# EAGLE design AJH_as3340_20 (EAGLE 9.6.2)
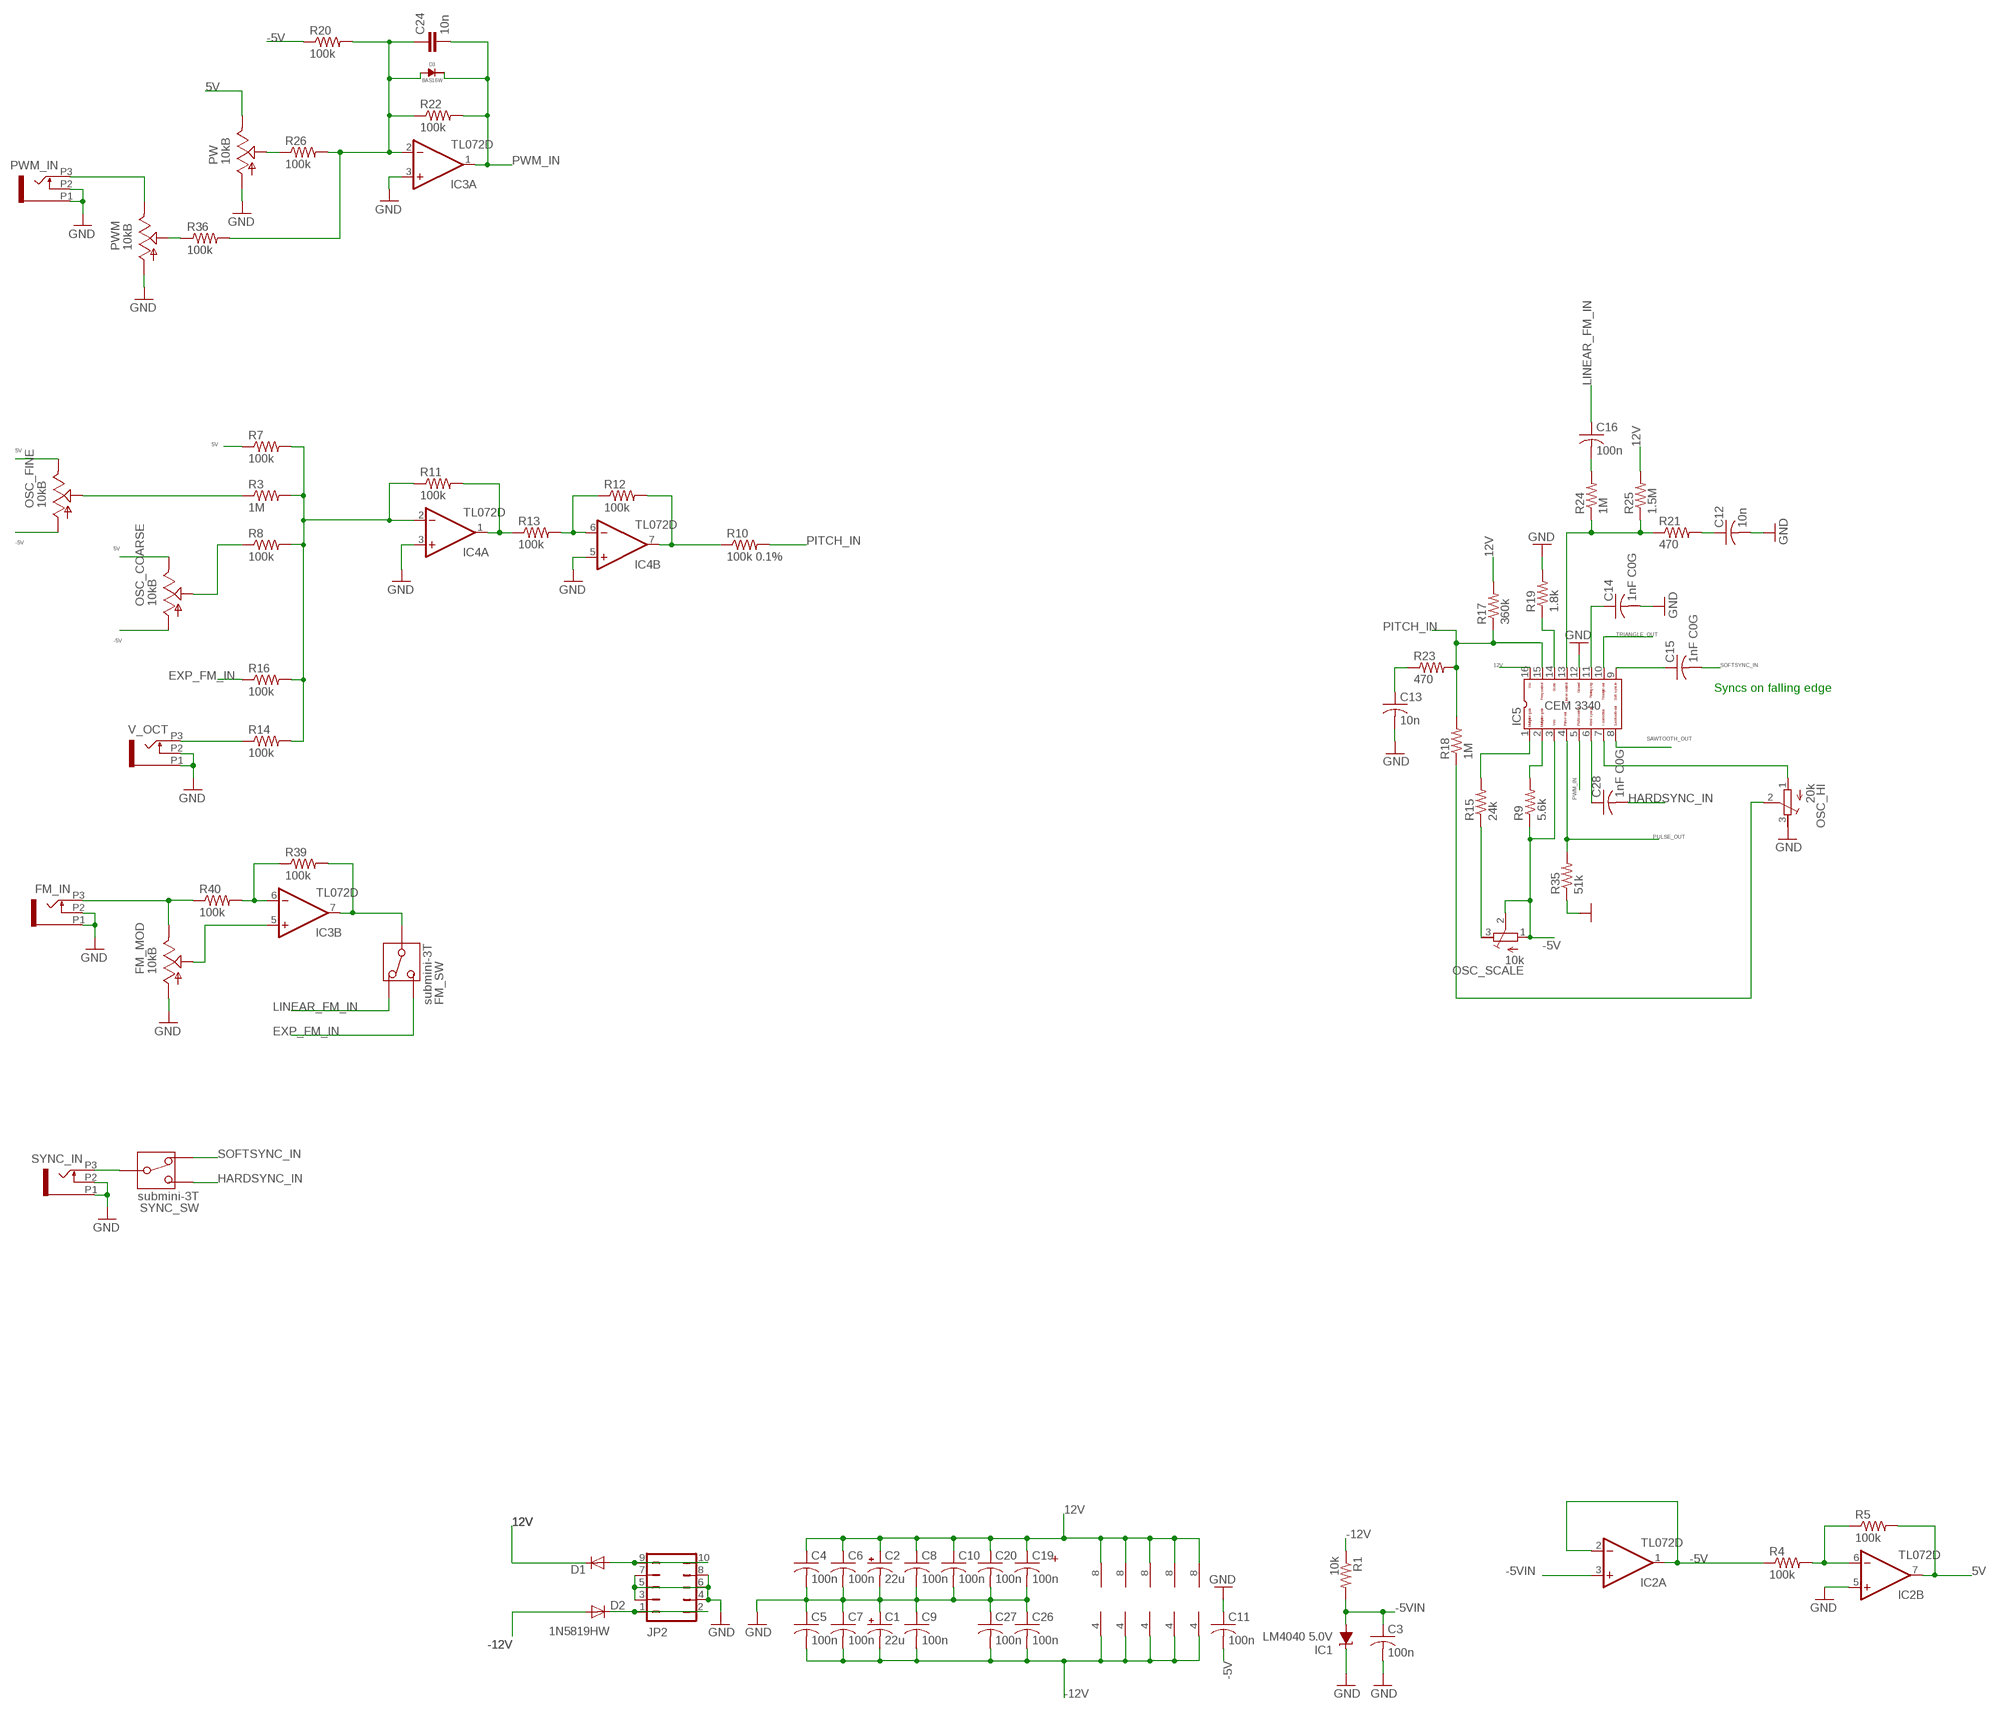
[diagram p0: schematic, sheet 1, part 1 of 2]
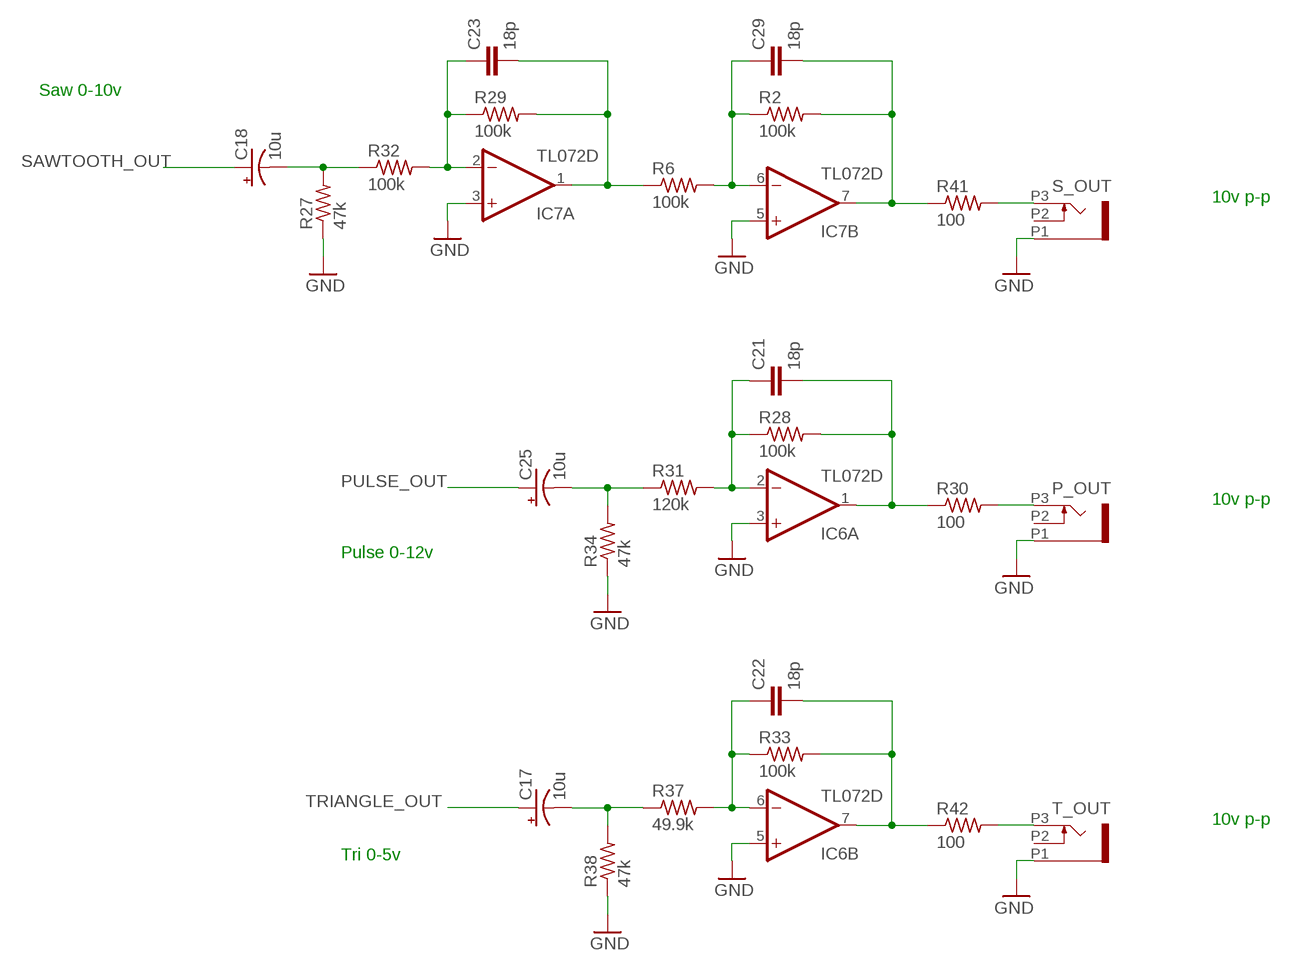
[diagram p1: schematic, sheet 1, part 2 of 2]

## Parts
C1  22u  CPOL-USB  [PANASONIC_B]
C2  22u  CPOL-USB  [PANASONIC_B]
C3  100n  C-USC0603  [C0603]
C4  100n  C-USC0603  [C0603]
C5  100n  C-USC0603  [C0603]
C6  100n  C-USC0603  [C0603]
C7  100n  C-USC0603  [C0603]
C8  100n  C-USC0603  [C0603]
C9  100n  C-USC0603  [C0603]
C10  100n  C-USC0603  [C0603]
C11  100n  C-USC0603  [C0603]
C12  10n  C-USC0603  [C0603]
C13  10n  C-USC0603  [C0603]
C14  1nF C0G  C-USC0603  [C0603]
C15  1nF C0G  C-USC0603  [C0603]
C16  100n  C-USC0603  [C0603]
C17  10u  CPOL-USB  [PANASONIC_B]
C18  10u  CPOL-USB  [PANASONIC_B]
C19  100n  C-USC0603  [C0603]
C20  100n  C-USC0603  [C0603]
C21  18p  C-EUC0603  [C0603]
C22  18p  C-EUC0603  [C0603]
C23  18p  C-EUC0603  [C0603]
C24  10n  C-EUC0603  [C0603]
C25  10u  CPOL-USB  [PANASONIC_B]
C26  100n  C-USC0603  [C0603]
C27  100n  C-USC0603  [C0603]
C28  1nF C0G  C-USC0603  [C0603]
C29  18p  C-EUC0603  [C0603]
D1  1N5819HW  DIODE-SOD123  [SOD123]
D2  1N5819HW  DIODE-SOD123  [SOD123]
D3  BAS16W  [SOT-323]
FM_IN  PJ301_THONKICONN6  [WQP_PJ_301M6]
FM_MOD  10kB  POT_USVERTICAL_PS  [ALPS_POT_VERTICAL_PS]
FM_SW  submini-3T  SPDTT  [SPDT-SUB]
IC1  LM4040 5.0V  LM4041C12DBZ  [DBZ_R-PDSO-G3]
IC2  TL072D  [SO08]
IC3  TL072D  [SO08]
IC4  TL072D  [SO08]
IC5  CEM3340SOIC16  [SO16]
IC6  TL072D  [SO08]
IC7  TL072D  [SO08]
JP2  JP5Q  [JP5Q]
OSC_COARSE  10kB  POT_USVERTICAL  [ALPS_POT_VERTICAL]
OSC_FINE  10kB  POT_USVERTICAL  [ALPS_POT_VERTICAL]
OSC_HI  20k  R-TRIMM3296X  [RTRIM3296X]
OSC_SCALE  10k  R-TRIMM3296X  [RTRIM3296X]
P_OUT  PJ301_THONKICONN6  [WQP_PJ_301M6]
PW  10kB  POT_USVERTICAL_PS  [ALPS_POT_VERTICAL_PS]
PWM  10kB  POT_USVERTICAL_PS  [ALPS_POT_VERTICAL_PS]
PWM_IN  PJ301_THONKICONN6  [WQP_PJ_301M6]
R1  10k  R-US_R0603  [R0603]
R2  100k  R-US_R0603  [R0603]
R3  1M  R-US_R0603  [R0603]
R4  100k  R-US_R0603  [R0603]
R5  100k  R-US_R0603  [R0603]
R6  100k  R-US_R0603  [R0603]
R7  100k  R-US_R0603  [R0603]
R8  100k  R-US_R0603  [R0603]
R9  5.6k  R-US_R0603  [R0603]
R10  100k 0.1%  R-US_R0603  [R0603]
R11  100k  R-US_R0603  [R0603]
R12  100k  R-US_R0603  [R0603]
R13  100k  R-US_R0603  [R0603]
R14  100k  R-US_R0603  [R0603]
R15  24k  R-US_R0603  [R0603]
R16  100k  R-US_R0603  [R0603]
R17  360k  R-US_R0603  [R0603]
R18  1M  R-US_R0603  [R0603]
R19  1.8k  R-US_R0603  [R0603]
R20  100k  R-US_R0603  [R0603]
R21  470  R-US_R0603  [R0603]
R22  100k  R-US_R0603  [R0603]
R23  470  R-US_R0603  [R0603]
R24  1M  R-US_R0603  [R0603]
R25  1.5M  R-US_R0603  [R0603]
R26  100k  R-US_R0603  [R0603]
R27  47k  R-US_R0603  [R0603]
R28  100k  R-US_R0603  [R0603]
R29  100k  R-US_R0603  [R0603]
R30  100  R-US_R0603  [R0603]
R31  120k  R-US_R0603  [R0603]
R32  100k  R-US_R0603  [R0603]
R33  100k  R-US_R0603  [R0603]
R34  47k  R-US_R0603  [R0603]
R35  51k  R-US_R0603  [R0603]
R36  100k  R-US_R0603  [R0603]
R37  49.9k  R-US_R0603  [R0603]
R38  47k  R-US_R0603  [R0603]
R39  100k  R-US_R0603  [R0603]
R40  100k  R-US_R0603  [R0603]
R41  100  R-US_R0603  [R0603]
R42  100  R-US_R0603  [R0603]
S_OUT  PJ301_THONKICONN6  [WQP_PJ_301M6]
SYNC_IN  PJ301_THONKICONN6  [WQP_PJ_301M6]
SYNC_SW  submini-3T  SPDTT  [SPDT-SUB]
T_OUT  PJ301_THONKICONN6  [WQP_PJ_301M6]
V_OCT  PJ301_THONKICONN6  [WQP_PJ_301M6]

## Nets
5V [power]: IC2.7(B:OUT) OSC_COARSE.P$1(E) OSC_FINE.P$1(E) PW.P$1(E) R5.2 R7.1
12V [power]: C2.+ C4.1 C6.1 C8.1 C10.1 C19.1 C20.1 D1.C IC2.8(P:V+) IC3.8(P:V+) IC4.8(P:V+) IC5.16 IC6.8(P:V+) IC7.8(P:V+) R17.2 R25.2
-5V [power]: C11.2 IC2.1(A:OUT) IC2.2(A:-IN) IC5.3 OSC_COARSE.P$3(A) OSC_FINE.P$3(A) OSC_SCALE.1(E) OSC_SCALE.2(S) R4.1 R9.1 R20.1
-5VIN [power]: C3.1 IC1.2(A) IC2.3(A:+IN) R1.2
-12V [power]: C1.- C5.2 C7.2 C9.2 C26.2 C27.2 D2.A IC2.4(P:V-) IC3.4(P:V-) IC4.4(P:V-) IC6.4(P:V-) IC7.4(P:V-) R1.1
EXP_FM_IN: FM_SW.P$1 R16.1
GND [power]: C1.+ C2.- C3.2 C4.2 C5.1 C6.2 C7.1 C8.2 C9.1 C10.2 C11.1 C12.2 C13.2 C14.2 C19.2 C20.2 C26.1 C27.1 FM_IN.P1 FM_IN.P2 FM_MOD.P$3(A) IC1.1(C) IC2.5(B:+IN) IC3.3(A:+IN) IC4.3(A:+IN) IC4.5(B:+IN) IC5.12 IC6.3(A:+IN) IC6.5(B:+IN) IC7.3(A:+IN) IC7.5(B:+IN) JP2.3 JP2.4 JP2.5 JP2.6 JP2.7 JP2.8 OSC_HI.3(A) P_OUT.P1 PW.P$3(A) PWM.P$3(A) PWM_IN.P1 PWM_IN.P2 R19.2 R27.1 R34.1 R35.1 R38.1 S_OUT.P1 SYNC_IN.P1 SYNC_IN.P2 T_OUT.P1 V_OCT.P1 V_OCT.P2
HARDSYNC_IN: C28.2 SYNC_SW.P$1
LINEAR_FM_IN: C16.1 FM_SW.P$3
MAIN_CV1: PWM.P$1(E) PWM_IN.P3
N$1: PW.P$2(S) R26.1
N$2: R41.2 S_OUT.P3
N$3: FM_MOD.P$2(S) IC3.5(B:+IN)
N$4: OSC_COARSE.P$2(S) R8.1
N$5: IC3.6(B:-IN) R39.1 R40.2
N$6 [power]: D1.A JP2.9 JP2.10
N$7: IC4.2(A:-IN) R3.2 R7.2 R8.2 R11.1 R14.2 R16.2
N$8: IC4.1(A:OUT) R11.2 R13.1
N$9: IC4.6(B:-IN) R12.1 R13.2
N$10: R14.1 V_OCT.P3
N$11: OSC_FINE.P$2(S) R3.1
N$12: FM_SW.P$2 IC3.7(B:OUT) R39.2
N$13: IC2.6(B:-IN) R4.2 R5.1
N$14: P_OUT.P3 R30.2
N$15: C29.1 IC7.6(B:-IN) R2.1 R6.2
N$16: R42.2 T_OUT.P3
N$17: C18.- R27.2 R32.1
N$18: C25.- R31.1 R34.2
N$19: C17.- R37.1 R38.2
N$20 [power]: D2.C JP2.1 JP2.2
N$21: C23.1 IC7.2(A:-IN) R29.1 R32.2
N$23: C23.2 IC7.1(A:OUT) R6.1 R29.2
N$24: C21.2 IC6.1(A:OUT) R28.2 R30.1
N$25: C22.2 IC6.7(B:OUT) R33.2 R42.1
N$26: C22.1 IC6.6(B:-IN) R33.1 R37.2
N$27: C21.1 IC6.2(A:-IN) R28.1 R31.2
N$28: C15.1 IC5.9
N$29: C13.1 R23.1
N$30: OSC_HI.2(S) R18.1
N$31: IC5.1 R15.2
N$32: OSC_SCALE.3(A) R15.1
N$33: IC5.2 R9.2
N$34: IC5.14 R19.1
N$35: C14.1 IC5.11
N$36: C12.1 R21.2
N$37: IC5.13 R21.1 R24.1 R25.1
N$38: C16.2 R24.2
N$40: C29.2 IC7.7(B:OUT) R2.2 R41.1
N$82: FM_IN.P3 FM_MOD.P$1(E) R40.1
N$94: C28.1 IC5.6
N$100: IC5.7 OSC_HI.1(E)
N$103: PWM.P$2(S) R36.1
PITCH_IN: IC5.15 R10.2 R17.1 R18.2 R23.2
PRESUMMED_PITCH: IC4.7(B:OUT) R10.1 R12.2
PULSE_OUT: C25.+ IC5.4 R35.2
PWM_2_IN_SUM: C24.1 D3.ANODE IC3.2(A:-IN) R20.2 R22.1 R26.2 R36.2
PWM_IN: C24.2 D3.CATHODE IC3.1(A:OUT) IC5.5 R22.2
SAWTOOTH_OUT: C18.+ IC5.8
SOFTSYNC_IN: C15.2 SYNC_SW.P$3
SYNC_IN: SYNC_IN.P3 SYNC_SW.P$2
TRIANGLE_OUT: C17.+ IC5.10
Unconnected: P_OUT.P2 S_OUT.P2 T_OUT.P2

## Notes on the sheet
- Saw 0-10v
- 10v p-p
- Syncs on falling edge
- 10v p-p
- Pulse 0-12v
- 10v p-p
- Tri 0-5v
- +

## Library data of the parts
C1 C2 C17 C18 C25 = rcl:CPOL-US: POLARIZED CAPACITOR, American symbol
C3-C16 C19 C20 C26-C28 = rcl:C-US: CAPACITOR, American symbol
C21-C24 C29 = resistor:C-EU: CAPACITOR, European symbol
D1 D2 = diode:DIODE-: DIODE
D3 = FenixBase:BAS16W
FM_IN P_OUT PWM_IN S_OUT SYNC_IN T_OUT V_OCT = og-pj301_variations:PJ301_THONKICONN
FM_MOD PW PWM = pot-alps:POT_US
FM_SW SYNC_SW = malekko main:SPDT: SPDT Switch
IC1 = texas:LM4041: PRECISION MICROPOWER SHUNT VOLTAGE REFERENCE Source: http://focus.ti.com/lit/ds/slcs146e/slcs146e.pdf
IC2-IC4 IC6 IC7 = linear:TL072: OP AMP
IC5 = CEM:CEM3340: CEM 3340 VCO
JP2 = jumper:JP5Q: JUMPER
OSC_COARSE OSC_FINE = og-pots:POT_US
OSC_HI OSC_SCALE = rcl:R-TRIMM: Trimm resistor
R1-R42 = resistor:R-US_: RESISTOR, American symbol

## Net classes
0 default: width 0.203 mm, drill 0.203 mm, clearance 0.203 mm
1 power: width 0.305 mm, drill 0.305 mm, clearance 0.305 mm to class 0, clearance 0.305 mm

## Board
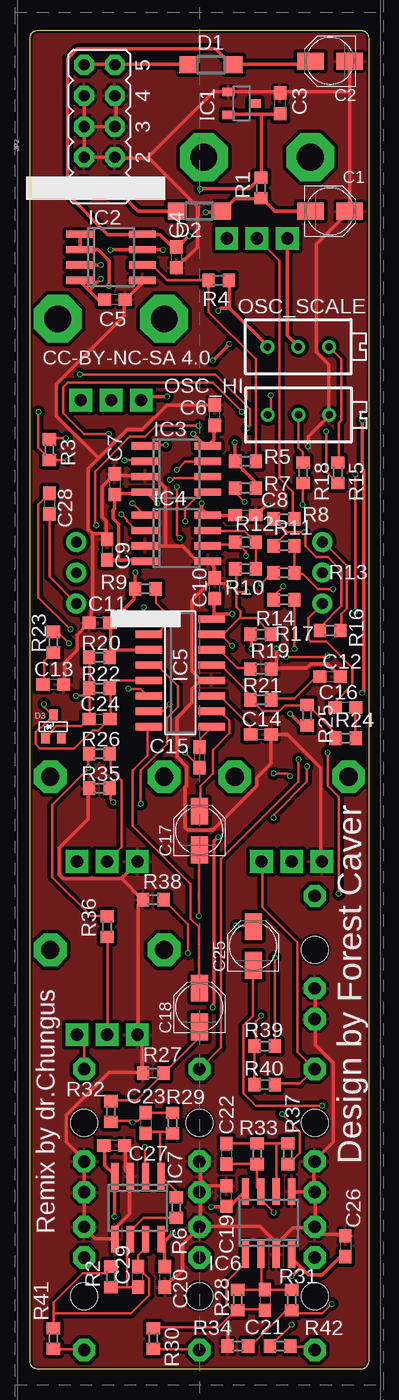
[diagram p2: board, top side]
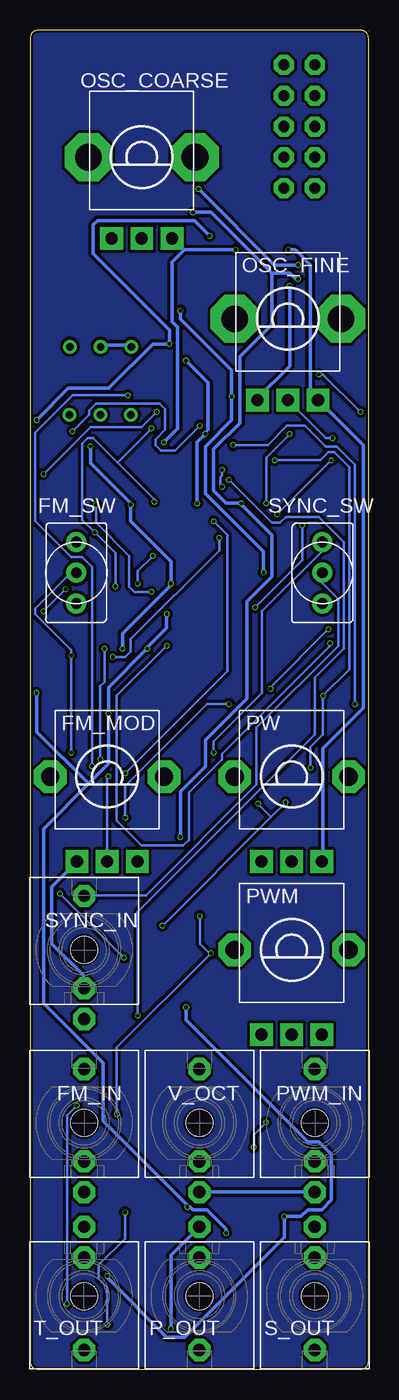
[diagram p3: board, bottom side, seen from below]

Size 27.94 x 110.49 mm. Coordinates in mm from the lower left corner, seen from the top.
Copper layers (1*16): Top 0.035mm / dielectric 1.6mm / Bottom 0.035mm
Design rules "jlcpcb-2layers *": minimum track width 5mil, minimum drill 0.3mm, track to track 10mil, track to pad 10mil, pad to pad 10mil, via to via 10mil, smd to smd 5mil, copper to edge 0.2mm, drill to drill 6mil, minimum pad ring 10mil, minimum via ring 3mil, stop-mask expansion 4mil, vias tented up to drill 0mil, thermal gap 10mil

### Footprints (pad centres in the part's own frame; a part is rotated, then mirrored left to right if it is on the bottom)
PANASONIC_B = smd 2.2 x 1.4: + 1.6,0; - -1.6,0
C0603 = smd 1.1 x 1: 1 -0.85,0; 2 0.85,0
SOD123 = smd 1.4 x 1.4: A 1.9,0; C -1.9,0
SOT-323 = smd 0.7 x 0.9: ANODE -0.65,-0.95; CATHODE 0,0.95; NC 0.65,-0.95
WQP_PJ_301M6 = drill 1.016 pad 1.778 octagon: P1 0,-5.715; P2 0,-3.175; P3 0,4.445 | hole 2.2: 0,0
ALPS_POT_VERTICAL_PS = drill 1 pad 1.88 square: P$1 -2.5,7; P$2 0,7; P$3 2.5,7 | drill 1.5 pad 2.54 octagon: P$4 -4.7,0; P$5 4.7,0
SPDT-SUB = drill 0.889 pad 1.651: P$1 0,2.54; P$2 0,0; P$3 0,-2.54
DBZ_R-PDSO-G3 = smd 0.7 x 1: 1 -0.95,-1.1; 2 0.95,-1.1; 3 0,1.1
SO08 = smd 0.6 x 2.2: 1 -1.905,-2.6; 2 -0.635,-2.6; 3 0.635,-2.6; 4 1.905,-2.6; 5 1.905,2.6; 6 0.635,2.6; 7 -0.635,2.6; 8 -1.905,2.6
SO16 = smd 0.6 x 2.2: 1 -4.445,-2.6; 2 -3.175,-2.6; 3 -1.905,-2.6; 4 -0.635,-2.6; 5 0.635,-2.6; 6 1.905,-2.6; 7 3.175,-2.6; 8 4.445,-2.6; 9 4.445,2.6; 10 3.175,2.6; 11 1.905,2.6; 12 0.635,2.6; 13 -0.635,2.6; 14 -1.905,2.6; 15 -3.175,2.6; 16 -4.445,2.6
JP5Q = drill 0.914 octagon: 1 -5.08,-1.27; 2 -5.08,1.27; 3 -2.54,-1.27; 4 -2.54,1.27; 5 0,-1.27; 6 0,1.27; 7 2.54,-1.27; 8 2.54,1.27; 9 5.08,-1.27; 10 5.08,1.27
ALPS_POT_VERTICAL = drill 1 pad 1.88 square: P$1 -2.5,6.7; P$2 0,6.7; P$3 2.5,6.7 | drill 2.2 pad 3.175 octagon: P$4 -4.4,0; P$5 4.4,0
RTRIM3296X = drill 0.61: 1 0,-2.54; 2 0,0; 3 0,2.54
R0603 = smd 1 x 1.1: 1 -0.85,0; 2 0.85,0

### Placement (x,y rotation side)
C1  24.77,95.57 0 top
C2  24.77,107.95 180 top
C3  20.64,104.46 90 top
C4  12.07,91.76 270 top
C5  6.99,88.27 180 top
C6  15.24,78.74 90 top
C7  6.99,73.03 270 top
C8  17.78,70.48 0 top
C9  6.35,67.64 270 top
C10  15.24,64.45 90 top
C11  5.71,61.59 0 top
C12  24.77,57.15 0 top
C13  1.9,56.52 0 top
C14  19.05,52.39 0 top
C15  13.97,50.48 270 top
C16  26.04,54.61 0 top
C17  13.97,44.45 90 top
C18  13.97,29.84 90 top
C19  16.19,14.29 90 top
C20  11.11,7.62 270 top
C21  19.37,5.71 270 top
C22  16.19,17.78 270 top
C23  9.53,20.32 270 top
C24  5.71,53.66 0 top
C25  18.41,34.92 90 top
C26  26.04,10.16 270 top
C27  6.94,18.46 180 top
C28  1.59,71.44 270 top
C29  8.89,7.62 90 top
D1  14.92,107.63 180 top
D2  13.97,95.57 0 top
D3  1.9,53.02 0 top
FM_IN  23.5,20.32 0 bottom
FM_MOD  21.59,48.89 180 bottom
FM_SW  24.13,65.72 0 bottom
IC1  17.46,104.46 270 top
IC2  6.67,91.76 270 top
IC3  12.07,74.3 270 top
IC4  12.07,68.58 270 top
IC5  12.38,57.47 270 top
IC6  19.68,12.06 0 top
IC7  8.89,13.34 180 top
JP2  5.71,102.55 90 top
OSC_COARSE  18.73,100.01 180 bottom
OSC_FINE  6.67,86.68 180 bottom
OSC_HI  22.16,78.75 270 top
OSC_SCALE  22.13,84.38 270 top
P_OUT  13.97,6.03 180 bottom
PW  6.35,48.89 180 bottom
PWM  6.35,34.61 180 bottom
PWM_IN  4.45,20.32 0 bottom
R1  19.05,97.47 90 top
R2  6.67,7.62 90 top
R3  1.59,75.88 270 top
R4  15.56,89.85 180 top
R5  17.78,74.93 180 top
R6  12.07,13.34 270 top
R7  17.78,72.71 180 top
R8  20.96,70.17 180 top
R9  9.5,64.39 0 top
R10  17.78,66.04 180 top
R11  20.96,67.94 0 top
R12  17.78,68.26 0 top
R13  20.96,65.72 180 top
R14  20.96,63.5 180 top
R15  25.4,73.98 270 top
R16  24.77,60.96 180 top
R17  19.05,60.64 180 top
R18  22.54,73.98 270 top
R19  19.05,57.78 0 top
R20  5.71,58.74 180 top
R21  19.05,55.25 0 top
R22  5.71,56.2 0 top
R23  1.9,60.01 90 top
R24  26.04,52.07 0 top
R25  22.86,53.98 270 top
R26  5.71,50.8 180 top
R27  10.16,24.45 0 top
R28  17.14,5.71 270 top
R29  11.75,20.32 270 top
R30  10.16,2.54 270 top
R31  21.59,5.71 90 top
R32  6.67,21.27 270 top
R33  18.73,17.78 270 top
R34  17.14,1.9 0 top
R35  5.71,47.94 0 top
R36  6.35,36.51 90 top
R37  21.27,17.78 90 top
R38  10.16,38.73 0 top
R39  19.37,26.67 0 top
R40  19.37,23.49 180 top
R41  1.9,2.54 270 top
R42  20.64,1.9 0 top
S_OUT  4.45,6.03 180 bottom
SYNC_IN  23.5,34.61 0 bottom
SYNC_SW  3.81,65.72 180 bottom
T_OUT  23.5,6.03 180 bottom
U$1  [EURO_PCB_6HP]  -1.27,-8.89 0 top  (outside the outline)
V_OCT  13.97,20.32 0 bottom

### Tracks (layer width: path | path; a pad name or v marks a point on that pad's centre or on a via)
5V  (via drill 0.3)
  Top 0.305: R7.1 18.62,72.72 18.62,73.18 16.9,74.89 R5.2 16.9,75.01 v16.9,76.49 | v10.96,92.38 9.36,92.38 IC2.7 9.13,92.38 v6.62,92.38
  Bottom 0.305: 15.3,92.38 v10.96,92.38 | 15.3,92.38 16.22,93.29 OSC_COARSE.P$1 | v16.9,76.49 15.76,77.64 15.76,85.98 16.22,86.44 16.22,91.35 15.3,92.27 15.3,92.38 | PW.P$1 3.76,41.97 3.76,51.23 0.44,54.55 0.44,76.26 4.1,79.92 OSC_FINE.P$1 4.22,80.03 4.79,80.61 4.79,91.12 6.04,92.38 v6.62,92.38
12V  (via drill 0.3)
  Top 0.305: C6.1 15.19,77.86 15.19,76.72 14.73,76.26 IC3.8 14.62,76.26 14.39,76.26 v13.47,77.18 | C8.1 16.9,70.43 14.73,70.43 IC4.8 14.62,70.55 14.16,71.01 v14.16,71.46 | C2.+ 23.08,107.92 22.85,107.7 16.9,107.7 D1.C 16.68,107.58 15.3,108.95 3.87,108.95 3.07,108.15 3.07,96.95 6.39,93.64 9.13,93.64 IC2.8 9.36,93.64 10.73,93.64 11.76,92.61 11.99,92.61 C4.1 12.22,92.61 v13.13,93.52 | v16.45,84.61 v15.07,83.24 | IC6.8 17.7,14.66 16.56,13.51 16.22,13.51 C19.1 16.1,13.4 v14.96,13.4 | C20.1 11.07,8.48 11.07,10.43 10.85,10.66 IC7.8 11.07,10.54 v11.76,11.23 | 15.19,62.32 15.19,62.09 15.07,61.98 IC5.16 | 15.19,62.32 15.19,63.58 C10.1 | v21.48,54.09 22.39,53.17 22.85,53.17 R25.2 | v18.28,59.46 18.28,60.6 R17.2 | v16.68,62.32 15.19,62.32 | v27.42,78.32 27.42,74.32 27.53,74.21 27.53,55.92 v27.42,55.8
  Bottom 0.305: v14.16,71.46 14.16,76.49 v13.47,77.18 13.47,77.29 13.25,77.52 13.25,81.41 v15.07,83.24 | v13.13,93.52 14.39,94.78 22.39,94.78 22.73,94.44 22.73,92.04 16.45,85.75 v16.45,84.61 17.82,84.61 21.48,80.95 24.79,80.95 v27.42,78.32 | v11.76,11.23 11.76,11.57 13.36,13.17 14.5,13.17 14.73,13.4 v14.96,13.4 14.96,13.51 21.93,20.48 21.93,25.29 26.85,30.2 26.85,44.6 23.13,48.32 | v16.68,62.32 16.68,61.18 18.28,59.58 v18.28,59.46 21.48,56.26 v21.48,54.09 21.48,49.97 23.13,48.32 | v27.42,55.8 27.42,52.6 23.13,48.32
-5V  (via drill 0.3)
  Top 0.305: 16.45,87.58 16.45,89.75 R4.1 | 16.45,87.58 19.53,84.49 OSC_SCALE.1 | OSC_COARSE.P$3 21.25,93.29 21.25,85.29 22.05,84.49 OSC_SCALE.2 | 6.62,59.35 6.62,61.52 C11.2 6.62,61.63 8.56,63.58 8.56,64.38 R9.1 8.67,64.49 v8.67,65.75 | 6.62,59.35 6.62,58.78 R20.1 | 6.62,59.35 9.7,59.35 IC5.3 | IC2.1 4.1,93.64 4.1,92.49 IC2.2 4.22,92.38 5.59,92.38 6.5,91.47 v6.5,89.41 | v11.3,80.26 9.47,80.26 9.25,80.03 OSC_FINE.P$3 | 16.45,87.58 15.76,87.58 v15.53,87.35
  Bottom 0.305: OSC_SCALE.2 22.05,84.49 19.65,84.49 OSC_SCALE.1 | v6.5,89.41 6.5,82.78 9.25,80.03 OSC_FINE.P$3 | v8.67,65.75 8.67,67.46 13.47,72.26 13.47,76.15 11.3,78.32 v11.3,80.26 11.3,82.44 15.53,86.67 v15.53,87.35
-5VIN  (via drill 0.3)
  Top 0.305: 19.07,103.58 20.56,103.58 C3.1 | 19.07,103.58 16.45,103.58 IC1.2 | 19.07,103.58 19.07,98.32 R1.2 18.96,98.32 18.05,97.41 v14.05,97.41 | v5.82,91.12 IC2.3
  Bottom 0.305: v5.82,91.12 7.76,91.12 v14.05,97.41
-12V  (via drill 0.3)
  Top 0.305: C27.2 6.16,18.43 6.16,16.83 6.96,16.03 IC7.4 6.96,15.8 v6.96,12.6 | 22.33,8.43 21.59,9.17 IC6.4 | 22.33,8.43 22.96,7.8 24.11,7.8 25.59,9.28 25.93,9.28 C26.2 | 22.33,8.43 v21.59,7.68 | 7.3,66.78 9.36,66.78 IC4.4 | 7.3,66.78 6.39,66.78 C9.2 | 7.3,66.78 7.3,69.75 6.85,70.21 6.85,70.89 6.96,71.01 6.96,72.03 C7.2 7.07,72.26 9.25,72.26 9.36,72.38 IC3.4 9.59,72.38 v10.5,71.46 | C5.2 5.59,88.27 4.85,89.01 | 4.85,89.01 4.1,89.75 IC2.4 | C1.- 23.08,95.58 20.22,95.58 19.19,96.61 R1.1 18.96,96.61 16.9,96.61 D2.A 15.76,95.47 v14.5,95.47 | v5.82,89.98 4.85,89.01 | v15.07,29.86 15.07,30.09 15.19,30.2 15.19,43.57 v15.53,43.92
  Bottom 0.305: v21.59,7.68 21.59,7.57 16.68,2.65 15.19,2.65 6.96,10.88 v6.96,12.6 5.59,12.6 5.02,13.17 3.87,13.17 3.07,13.97 3.07,17.74 4.1,18.77 5.02,18.77 15.07,28.83 v15.07,29.86 | v5.82,89.98 6.04,89.98 6.5,90.44 7.99,90.44 | 7.99,90.44 13.02,95.47 v14.5,95.47 | 7.99,90.44 7.99,86.21 10.62,83.58 10.62,78.09 12.79,75.92 12.79,72.49 11.76,71.46 v10.5,71.46 10.5,71.35 7.99,68.83 7.99,65.41 10.05,63.35 10.05,55.35 13.47,51.92 13.47,49.75 15.53,47.69 v15.53,43.92
EXP_FM_IN
  Top 0.203: R16.1 25.71,61.06 25.71,62.32 26.16,62.78 26.16,66.32 24.22,68.26 FM_SW.P$1
GND  (via drill 0.3)
  Top 0.305: SYNC_IN.P2 23.53,31.34 23.53,28.94 SYNC_IN.P1 23.53,28.83 23.53,26.77 25.02,25.29 25.02,18.77 23.53,17.29 FM_IN.P2 23.42,17.06 23.42,14.77 FM_IN.P1 | FM_MOD.P$3 23.99,41.97 23.99,49.63 21.25,52.38 19.99,52.38 C14.2 19.88,52.26 19.88,49.97 18.73,48.83 18.73,48.15 15.07,44.49 13.02,44.49 12.79,44.72 12.79,48.03 12.9,48.15 12.9,49.75 12.1,50.55 12.1,53.75 13.36,55 13.36,56.15 14.05,56.83 IC5.12 14.16,56.83 13.36,57.63 13.36,63.46 15.19,65.29 C10.2 | 7.53,40.49 2.73,40.49 2.39,40.83 2.39,43 4.79,45.4 4.79,47.92 R35.1 | 7.53,40.49 8.9,41.86 PW.P$3 | 7.53,40.49 9.25,38.77 R38.1 9.25,38.66 8.9,38.32 8.9,27.69 PWM.P$3 8.9,27.57 9.25,27.23 9.25,24.49 R27.1 9.13,24.49 6.5,24.49 2.96,20.94 2.96,18.77 4.45,17.29 PWM_IN.P2 PWM_IN.P1 S_OUT.P1 4.45,11.68 5.36,10.77 6.96,10.77 IC7.5 6.96,10.88 6.96,11.57 8.22,12.83 8.22,15.8 IC7.3 8.22,16.03 7.87,16.37 7.87,18.43 C27.1 | IC6.5 23.42,14.66 FM_IN.P1 | C26.1 25.93,11.11 24.11,11.11 23.53,11.68 T_OUT.P1 | T_OUT.P1 23.42,11.68 21.7,11.68 20.33,10.31 20.33,9.51 IC6.3 20.33,10.43 18.96,11.8 14.16,11.8 P_OUT.P1 | FM_IN.P1 23.53,14.54 23.53,11.8 T_OUT.P1 | C19.2 16.1,15.11 14.5,15.11 14.05,14.66 V_OCT.P1 | V_OCT.P2 14.05,17.06 14.05,15.68 14.5,15.23 V_OCT.P1 | C20.2 11.19,6.88 11.76,7.45 11.88,7.45 12.56,8.14 12.56,10.31 13.93,11.68 P_OUT.P1 | v16.33,3.34 16.33,1.97 R34.1 | V_OCT.P1 14.05,14.54 14.05,11.8 P_OUT.P1 | 9.82,99.92 10.22,99.52 13.82,95.92 13.82,92.61 12.79,91.58 12.68,91.58 12.1,91.01 C4.2 | 9.82,99.92 9.74,100 15.15,105.41 16.22,105.41 IC1.1 16.45,105.41 20.56,105.41 C3.2 20.68,105.41 26.39,105.41
  Top 0.305: 9.82,99.92 7.07,99.92 JP2.3 6.85,100.04 4.45,100.04 JP2.4 JP2.6 | JP2.6 JP2.5 7.07,102.67 7.07,105.07 JP2.7 | JP2.6 JP2.8 | 26.39,105.41 26.39,107.92 C2.- | 26.39,105.41 26.39,95.58 C1.+ 26.28,95.47 23.65,92.84 23.65,83.92 24.68,82.89 24.68,78.78 OSC_HI.3 24.68,78.66 22.96,76.95 v22.96,76.15 | C12.2 25.59,57.17 24.56,58.2 23.19,58.2 22.85,57.86 19.99,57.86 R19.2 20.33,57.97 v20.33,59.46 | C10.2 15.19,65.41 15.19,66.2 14.73,66.66 IC4.5 14.62,66.78 13.7,66.78 12.56,67.92 11.19,67.92 | v19.65,71.35 19.53,71.35 18.73,70.55 C8.2 | v16.33,64.83 15.65,64.83 15.3,65.18 C10.2 | 11.19,67.92 9.47,67.92 IC4.3 | C13.2 2.85,56.6 2.85,58.32 3.87,59.35 3.87,60.6 4.79,61.52 C11.1 5.02,61.63 5.02,62.55 5.13,62.66 5.13,68.95 | IC2.5 9.36,89.75 7.87,88.27 C5.1 7.76,88.15 7.76,86.89 2.16,81.29 2.16,78.66 5.64,75.18 | 5.64,75.18 4.79,74.32 4.79,69.29 5.13,68.95 | 5.64,75.18 7.99,77.52 9.25,77.52 11.3,79.58 15.19,79.58 C6.2 | 5.13,68.95 6.16,68.95 C9.1 6.27,68.49 6.27,69.98 5.93,70.32 5.93,72.83 6.96,73.86 C7.1 7.07,73.75 9.36,73.75 IC3.3 9.59,73.64 10.27,73.64 11.19,72.72 11.19,67.92
  Bottom 0.305: SYNC_IN.P2 23.53,31.46 23.53,32.49 26.16,35.12 26.16,39.8 24.11,41.86 FM_MOD.P$3 | v16.33,3.34 16.33,9.4 14.05,11.68 P_OUT.P1 | PWM_IN.P1 4.45,14.66 13.93,14.66 V_OCT.P1 | v20.33,59.46 20.33,60.72 16.33,64.72 v16.33,64.83 16.33,66.66 19.65,69.98 v19.65,71.35 19.65,71.46 22.96,74.78 v22.96,76.15
  pour Top: 0,0 27.94,0 27.94,110.49 0,110.49
HARDSYNC_IN
  Top 0.203: C28.2 1.59,65.41 SYNC_SW.P$1
LINEAR_FM_IN
  Top 0.203: C16.1 25.25,54.66 25.25,55.12 26.62,56.49 26.62,57.86 24.45,60.03 23.19,60.03 22.96,60.26 22.96,61.98 24.11,63.12 FM_SW.P$3
MAIN_CV1
  Top 0.203: PWM_IN.P3 4.45,27 3.87,27.57 PWM.P$1
N$1
  Top 0.203: R26.1 6.62,50.77 6.62,49.52 7.53,48.6 7.53,43.12 6.39,41.97 PW.P$2
N$2
  Top 0.203: R41.2 1.93,1.63 4.45,1.63 S_OUT.P3
N$3  (via drill 0.3)
  Top 0.203: v12.79,69.98 12.79,71.01 14.16,72.38 14.62,72.38 IC3.5 | v20.1,49.17 21.25,49.17 v21.48,48.95
  Bottom 0.203: FM_MOD.P$2 21.59,44.49 21.59,44.72 21.59,46.77 21.59,48.74 21.59,48.95 v21.48,48.95 | v12.79,69.98 11.65,68.83 11.65,57.63 v20.1,49.17
N$4
  Top 0.203: R8.1 21.7,70.21 21.7,72.38 20.56,73.52 20.56,91.47 18.73,93.29 OSC_COARSE.P$2
N$5  (via drill 0.3)
  Top 0.203: R40.2 18.5,23.57 18.5,26.66 R39.1 18.62,26.77 18.62,28.71 v19.07,29.17 | v11.53,73.41 11.76,73.41 11.88,73.52 14.5,73.52 14.62,73.64 IC3.6
  Bottom 0.203: v19.07,29.17 19.07,37.74 4.45,52.38 4.45,57.06 2.04,59.46 2.04,68.26 4.1,70.32 6.85,70.32 7.3,69.86 7.99,69.86 v11.53,73.41
N$6
  Top 0.305: D1.A 13.02,107.7 7.07,107.7 JP2.9 6.85,107.7 4.45,107.7 JP2.10
N$7  (via drill 0.3)
  Top 0.203: v3.07,75.01 1.59,75.01 R3.2 1.59,75.12 0.67,76.03 v0.67,79.01 | v7.53,70.55 7.99,70.09 7.99,69.98 8.67,69.29 9.36,69.29 IC4.2 | v20.9,64.61 20.22,63.92 20.22,63.58 R14.2 | 21.25,69.06 v22.62,69.06 22.73,68.95 22.73,67.92 23.65,67 24.56,67 25.71,65.86 25.71,63 23.99,61.29 23.99,61.06 R16.2 | 21.25,69.06 20.22,70.09 R8.2 | v17.7,71.58 17.02,72.26 17.02,72.61 R7.2 | 21.25,69.06 20.22,68.03 R11.1 | v4.1,82.09 15.3,82.09 18.16,79.23 18.16,77.86 v17.93,77.64
  Bottom 0.203: v7.53,70.55 v3.07,75.01 | v20.9,64.61 20.9,67.35 v22.62,69.06 23.65,70.09 23.65,76.38 23.19,76.83 22.73,76.83 20.73,74.83 | v17.7,71.58 17.7,71.81 20.73,74.83 | v0.67,79.01 3.76,82.09 v4.1,82.09 | 20.73,74.83 v17.93,77.64
N$8  (via drill 0.3)
  Top 0.203: R11.2 21.82,67.92 21.82,65.75 R13.1 21.82,65.63 22.5,65.63 23.76,64.38 v25.02,64.38 | v26.85,73.86 v26.85,62.55 | v17.48,79.01 15.07,81.41 3.07,81.41 2.73,81.06 2.73,78.89 4.45,77.18 v6.5,77.18 | v8.45,71.46 9.36,70.55 IC4.1
  Bottom 0.203: v26.85,62.55 v25.02,64.38 | v26.85,73.86 22.96,77.75 18.73,77.75 v17.48,79.01 | v6.5,77.18 8.45,75.23 v8.45,71.46
N$9  (via drill 0.3)
  Top 0.203: v19.07,64.83 19.88,65.63 20.1,65.63 R13.2 | v17.82,67.12 17.82,67.46 17.02,68.26 R12.1 16.9,68.26 16.68,68.03 14.73,68.03 IC4.6
  Bottom 0.203: v19.07,64.83 19.07,65.86 v17.82,67.12
N$10  (via drill 0.3)
  Top 0.203: v21.82,59.46 21.82,63.46 R14.1 | v22.16,50.32 22.16,48.49 15.76,42.09 15.76,26.54 14.05,24.83 V_OCT.P3
  Bottom 0.203: v21.82,59.46 21.82,56.72 22.16,56.38 v22.16,50.32
N$11  (via drill 0.3)
  Top 0.203: v2.96,76.83 1.59,76.83 R3.1
  Bottom 0.203: v2.96,76.83 3.53,76.83 6.62,79.92 OSC_FINE.P$2
N$12  (via drill 0.3)
  Top 0.203: v20.22,33.97 20.22,26.77 R39.2 | v25.48,39.23 25.48,47.23 24.56,48.15 v24.56,50.89 | v12.1,74.21 12.79,74.89 14.62,74.89 IC3.7 | v12.1,72.83 12.1,68.83 v12.33,68.61 | v21.13,58.78 24.45,58.78 v24.56,58.89
  Bottom 0.203: v25.48,39.23 v20.22,33.97 | v24.56,50.89 v24.56,58.89 24.56,59.35 27.53,62.32 27.53,62.78 24.68,65.63 24.22,65.63 FM_SW.P$2 | v12.1,74.21 12.1,73.75 12.22,73.64 12.22,72.95 v12.1,72.83 | v12.33,68.61 12.33,67.58 19.65,60.26 19.65,59.23 20.1,58.78 v21.13,58.78
N$13
  Top 0.203: IC2.6 10.05,91.12 11.3,89.86 14.62,89.86 R4.2 14.73,89.75 14.73,87.24 18.62,83.35 18.62,75.01 R5.1
N$14
  Top 0.203: R30.2 10.16,1.63 13.93,1.63 P_OUT.P3
N$15
  Top 0.203: 7.99,6.77 8.79,6.77 C29.1 | 7.99,6.77 6.73,6.77 R2.1 | R6.2 11.99,12.48 9.36,12.48 8.33,11.45 8.33,10.77 IC7.6 8.22,10.66 7.99,10.43 7.99,6.77
N$16
  Top 0.203: R42.2 21.59,1.85 23.19,1.85 23.42,1.63 T_OUT.P3
N$17
  Top 0.203: R32.1 6.73,22.2 8.79,22.2 10.96,24.37 R27.2 11.07,24.49 13.93,27.34 13.93,28.14 C18.-
N$18  (via drill 0.3)
  Top 0.203: 21.59,4.83 21.13,4.83 18.28,1.97 18.05,1.97 R34.2 | v24.11,21.74 18.62,21.74 17.59,22.77 17.59,28.37 18.39,29.17 18.39,33.29 C25.- | v24.91,5.4 24.11,4.6 21.82,4.6 21.59,4.83 | 21.59,4.83 R31.1
  Bottom 0.203: v24.11,21.74 24.91,20.94 v24.91,5.4
N$19  (via drill 0.3)
  Top 0.203: v20.79,21.06 22.28,19.57 22.28,17.86 21.36,16.94 R37.1 | v13.02,34.31 13.02,36.72 11.07,38.66 R38.2 | v13.93,37.4 13.93,42.77 C17.-
  Bottom 0.203: v20.79,21.06 20.79,26.54 v13.02,34.31 13.13,34.31 13.93,35.12 v13.93,37.4
N$20
  Top 0.305: D2.C 11.99,95.58 8.9,95.58 7.07,97.41 JP2.1 6.85,97.52 4.45,97.52 JP2.2
N$21  (via drill 0.3)
  Top 0.203: 8.45,20.48 8.9,20.48 9.47,21.06 C23.1 9.59,21.17 11.65,21.17 R29.1 | 8.45,20.48 6.73,20.48 R32.2 | v9.47,18.31 9.47,16.03 IC7.2 | 8.45,20.48 v8.45,20.37
  Bottom 0.203: v9.47,18.31 9.47,19.34 v8.45,20.37
N$23
  Top 0.203: 10.73,19.57 11.65,19.57 R29.2 | 10.73,19.57 9.59,19.57 C23.2 | R6.1 11.99,14.2 11.99,14.77 10.85,15.91 IC7.1 10.73,16.03 10.73,19.57
N$24
  Top 0.203: R30.1 10.16,3.45 15.53,3.45 16.9,4.83 17.13,4.83 R28.2 | C21.2 19.3,4.94 17.25,4.94 R28.2 | IC6.1 17.7,9.4 17.7,8.71 16.22,7.23 16.22,5.4 16.79,4.83 R28.2
N$25  (via drill 0.3)
  Top 0.203: C22.2 16.22,16.94 18.73,16.94 R33.2 18.73,15 18.96,14.77 IC6.7 19.07,14.66 19.07,13.97 v20.1,12.94 | v21.59,3.68 19.88,1.97 R42.1
  Bottom 0.203: v21.59,3.68 21.59,6.77 22.28,7.45 22.28,8.6 20.1,10.77 v20.1,12.94
N$26
  Top 0.203: 18.73,18.66 16.22,18.66 C22.1 | 18.73,18.66 20.33,18.66 | 20.33,18.66 21.25,18.66 R37.2 | 18.73,18.66 R33.1 | 20.33,18.66 20.33,14.77 IC6.6
N$27
  Top 0.203: 19.07,6.54 19.3,6.54 C21.1 | 19.07,6.54 17.25,6.54 R28.1 | R31.2 21.59,6.54 19.42,6.54 C21.1 | 19.07,6.54 19.07,9.4 IC6.2 | 19.07,6.54 C21.1
N$28
  Top 0.203: C15.1 14.05,51.35 14.05,52.03 14.96,52.95 IC5.9
N$29
  Top 0.203: C13.1 1.13,56.6 1.13,58.43 1.82,59.12 R23.1
N$30
  Top 0.203: R18.1 22.5,74.89 22.5,75.69 22.16,76.03 22.16,78.66 OSC_HI.2
N$31  (via drill 0.3)
  Top 0.203: v24.45,77.41 24.45,74.09 25.36,73.18 R15.2 | v13.93,77.86 10.39,77.86 9.47,76.95 8.22,76.95 5.36,74.09 5.36,69.75 v5.47,69.63 | v9.36,62.89 9.36,62.32 9.7,61.98 IC5.1
  Bottom 0.203: v24.45,77.41 23.08,78.78 23.08,79.12 22.5,79.69 17.25,79.69 16.79,79.23 16.79,77.52 17.59,76.72 17.59,76.26 17.13,75.81 15.99,75.81 v13.93,77.86 | v5.47,69.63 5.47,66.78 v9.36,62.89
N$32
  Top 0.203: R15.1 25.48,74.89 25.48,78.09 25.71,78.32 25.71,83.35 OSC_SCALE.3
N$33
  Top 0.203: R9.2 10.39,64.38 10.39,63.23 11.3,62.32 11.3,61.52 10.5,60.72 9.82,60.72 IC5.2
N$34
  Top 0.203: R19.1 18.16,57.86 17.13,57.86 15.65,59.35 15.07,59.35 IC5.14
N$35
  Top 0.203: C14.1 18.16,52.49 18.16,53.06 15.76,55.46 15.07,55.46 IC5.11
N$36
  Top 0.203: R21.2 19.99,55.35 21.82,55.35 23.53,57.06 23.88,57.06 C12.1
N$37
  Top 0.203: R24.1 25.13,52.15 25.13,52.6 22.96,54.77 R25.1 22.85,54.77 21.02,54.77 20.56,54.32 19.19,54.32 18.28,55.23 R21.1 18.16,55.35 18.16,55.69 15.76,58.09 15.07,58.09 IC5.13
N$38
  Top 0.203: R24.2 26.85,52.15 26.85,54.55 C16.2
N$40
  Top 0.203: IC7.7 9.47,10.66 9.47,9.97 8.9,9.4 8.9,8.48 C29.2 8.9,8.37 9.82,7.45 9.82,6.08 8.33,4.6 1.93,4.6 | 1.93,4.6 1.93,5.51 4.33,7.91 6.16,7.91 6.62,8.37 R2.2 | 1.93,4.6 1.93,3.45 R41.1
N$41
  pour Bottom: 0,0 27.94,0 27.94,110.49 0,110.49
N$82
  Top 0.203: R40.1 20.22,23.57 22.28,23.57 23.42,24.71 FM_IN.P3 23.42,24.83 22.05,26.2 22.05,35.23 19.19,38.09 19.19,41.86 FM_MOD.P$1
N$94  (via drill 0.3)
  Top 0.203: v3.3,61.06 0.67,63.69 0.67,71.35 1.59,72.26 C28.1 | v8.1,56.15 9.13,56.15 9.7,55.58 IC5.6
  Bottom 0.203: v3.3,61.06 8.1,56.26 v8.1,56.15
N$100  (via drill 0.3)
  Top 0.203: v11.53,54.89 10.96,54.32 9.82,54.32 IC5.7 | v20.1,45.52 20.1,45.74 22.85,48.49 v22.85,49.75 | v19.88,80.38 19.88,79.01 19.65,78.78 OSC_HI.1
  Bottom 0.203: v11.53,54.89 13.36,54.89 20.1,48.15 v20.1,45.52 | v22.85,49.75 22.85,66.2 23.65,67 24.56,67 27.53,69.98 27.53,77.29 24.45,80.38 v19.88,80.38
N$103
  Top 0.203: R36.1 6.39,35.57 6.39,27.69 PWM.P$2
PITCH_IN  (via drill 0.3)
  Top 0.203: v3.19,59.92 2.27,60.83 1.93,60.83 R23.2 | v16.68,59.69 15.76,60.6 15.07,60.6 IC5.15 15.88,60.6 17.3,62.03 | 17.02,64.15 17.02,62.89 17.36,62.55 17.36,62.09 17.3,62.03 | 17.02,64.15 17.02,65.98 R10.2 | R17.1 19.88,60.72 18.62,61.98 17.36,61.98 17.3,62.03 | v22.5,71.35 22.5,73.06 R18.2 | 17.02,64.15 v17.93,64.15
  Bottom 0.203: v3.19,59.92 3.19,59.69 12.1,50.77 12.1,50.32 14.85,47.57 14.85,43.69 15.3,43.23 18.73,43.23 20.79,45.29 20.79,55.58 v16.68,59.69 | v22.5,71.35 22.5,69.86 19.76,67.12 19.76,64.61 19.3,64.15 v17.93,64.15
PRESUMMED_PITCH
  Top 0.203: 18.62,68.26 18.62,66.09 R10.1 | 18.62,68.26 17.7,69.18 14.73,69.18 IC4.7 | 18.62,68.26 R12.2
PULSE_OUT  (via drill 0.3)
  Top 0.203: v6.85,46.77 6.62,47 6.62,47.92 R35.2 | v17.02,36.6 18.39,36.6 C25.+ | v9.13,46.66 9.13,49.4 11.3,51.58 11.3,53.75 12.22,54.66 12.22,56.38 10.5,58.09 9.82,58.09 IC5.4
  Bottom 0.203: v17.02,36.6 8.04,45.57 | 8.04,45.57 v6.85,46.77 | 8.04,45.57 v9.13,46.66
PWM_2_IN_SUM  (via drill 0.3)
  Top 0.203: R26.2 4.79,50.77 v4.79,49.63 4.79,49.52 1.82,46.55 1.82,40.6 5.02,37.4 6.27,37.4 R36.2 | R20.2 4.9,58.66 4.9,56.26 R22.1 4.9,56.15 4.9,55.58 | D3.ANODE 1.36,52.15 1.82,52.6 1.82,52.72 2.16,53.06 4.22,53.06 4.79,53.63 C24.1 4.9,53.75 4.9,55.58 | v7.76,75.01 9.36,75.01 IC3.2 | 4.9,55.58 v3.76,55.58
  Bottom 0.203: v7.76,75.01 3.99,75.01 3.3,75.69 2.85,75.69 1.59,74.44 1.59,57.75 v3.76,55.58 3.76,52.38 4.79,51.35 v4.79,49.63
PWM_IN  (via drill 0.3)
  Top 0.203: v11.19,76.26 9.47,76.26 IC3.1 | v1.13,54.89 1.13,54.66 1.82,53.98 D3.CATHODE 1.82,53.86 0.9,52.95 0.79,52.95 0.44,52.6 0.44,51.58 0.79,51.23 3.65,51.23 5.13,52.72 5.59,52.72 6.5,53.63 C24.2 6.62,53.75 6.62,56.15 R22.2 6.62,56.26 7.19,56.83 IC5.5
  Bottom 0.203: v11.19,76.26 8.33,76.26 6.73,77.86 5.24,77.86 3.53,76.15 2.62,76.15 1.13,74.66 v1.13,54.89
SAWTOOTH_OUT
  Top 0.203: IC5.8 9.7,52.95 9.7,50.66 8.45,49.4 8.45,44.83 13.25,40.03 13.25,37.17 13.93,36.49 13.93,31.46 C18.+
SOFTSYNC_IN  (via drill 0.3)
  Top 0.203: v12.79,50.89 13.93,49.75 C15.2
  Bottom 0.203: v12.79,50.89 12.79,51.8 8.79,55.8 8.79,62.55 3.87,67.46 3.87,68.26 SYNC_SW.P$3
SYNC_IN
  Bottom 0.203: SYNC_SW.P$2 3.76,65.63 3.76,64.83 2.5,63.58 2.5,59.69 9.25,52.95 9.25,48.26 18.39,39.12 23.42,39.12 SYNC_IN.P3
TRIANGLE_OUT
  Top 0.203: C17.+ 14.05,46.09 14.05,48.15 15.07,49.17 15.07,51.12 16.45,52.49 16.45,53.52 15.76,54.2 15.07,54.2 IC5.10

### Text on the board
tNames: CC-BY-NC-SA 4.0 | Design by Forest Caver | Remix by dr.Chungus